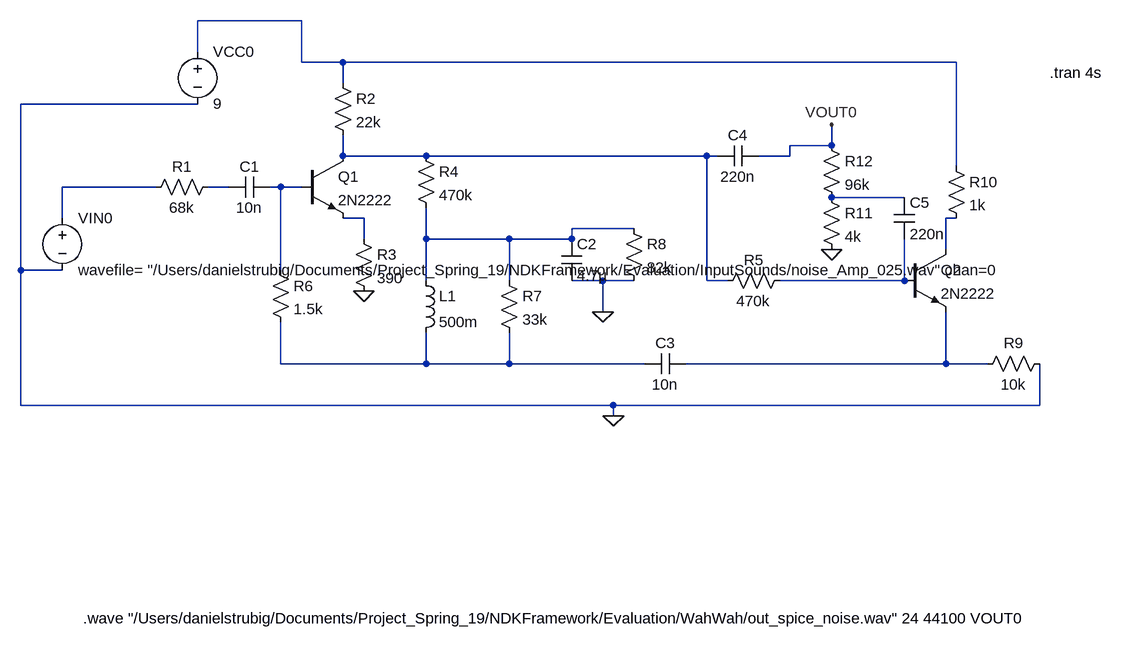
[diagram p0: schematic WahWahPot.asc]
WahWahPot.asc, the LTspice schematic file:
Version 4
SHEET 1 1044 680
WIRE -1232 -816 -1392 -816
WIRE -1392 -768 -1392 -816
WIRE -1232 -752 -1232 -816
WIRE -1168 -752 -1232 -752
WIRE -224 -752 -1168 -752
WIRE -1168 -720 -1168 -752
WIRE -1392 -688 -1664 -688
WIRE -416 -624 -416 -656
WIRE -416 -624 -480 -624
WIRE -1168 -608 -1168 -640
WIRE -1040 -608 -1168 -608
WIRE -608 -608 -1040 -608
WIRE -592 -608 -608 -608
WIRE -480 -608 -480 -624
WIRE -480 -608 -528 -608
WIRE -224 -592 -224 -752
WIRE -1456 -560 -1600 -560
WIRE -1344 -560 -1376 -560
WIRE -1264 -560 -1280 -560
WIRE -1232 -560 -1264 -560
WIRE -304 -544 -416 -544
WIRE -1600 -512 -1600 -560
WIRE -1136 -512 -1168 -512
WIRE -224 -512 -240 -512
WIRE -720 -496 -816 -496
WIRE -1136 -480 -1136 -512
WIRE -1040 -480 -1040 -528
WIRE -912 -480 -1040 -480
WIRE -816 -480 -816 -496
WIRE -816 -480 -912 -480
WIRE -240 -464 -240 -512
WIRE -1664 -432 -1664 -688
WIRE -1600 -432 -1664 -432
WIRE -1264 -432 -1264 -560
WIRE -1040 -416 -1040 -480
WIRE -912 -416 -912 -480
WIRE -768 -416 -816 -416
WIRE -720 -416 -768 -416
WIRE -608 -416 -608 -608
WIRE -576 -416 -608 -416
WIRE -304 -416 -304 -480
WIRE -304 -416 -496 -416
WIRE -768 -368 -768 -416
WIRE -1264 -288 -1264 -352
WIRE -1040 -288 -1040 -336
WIRE -1040 -288 -1264 -288
WIRE -912 -288 -912 -336
WIRE -912 -288 -1040 -288
WIRE -704 -288 -912 -288
WIRE -240 -288 -240 -368
WIRE -240 -288 -640 -288
WIRE -176 -288 -240 -288
WIRE -1664 -224 -1664 -432
WIRE -752 -224 -1664 -224
WIRE -96 -224 -96 -288
WIRE -96 -224 -752 -224
WIRE -752 -208 -752 -224
FLAG -416 -464 0
FLAG -752 -208 0
FLAG -1136 -400 0
FLAG -768 -368 0
FLAG -416 -656 VOUT0
SYMBOL /voltage -1600 -528 R0
SYMATTR InstName VIN0
SYMATTR Value wavefile= "/Users/danielstrubig/Documents/Project_Spring_19/NDKFramework/Evaluation/InputSounds/noise_Amp_025.wav" chan=0
SYMBOL /voltage -1392 -784 R0
SYMATTR InstName VCC0
SYMATTR Value 9
SYMBOL /res -1472 -544 R270
WINDOW 0 32 56 VTop 2
WINDOW 3 0 56 VBottom 2
SYMATTR InstName R1
SYMATTR Value 68k
SYMBOL /res -1184 -736 R0
SYMATTR InstName R2
SYMATTR Value 22k
SYMBOL /res -1152 -496 R0
SYMATTR InstName R3
SYMATTR Value 390
SYMBOL /res -1056 -624 R0
SYMATTR InstName R4
SYMATTR Value 470k
SYMBOL /res -480 -432 R90
WINDOW 0 0 56 VBottom 2
WINDOW 3 32 56 VTop 2
SYMATTR InstName R5
SYMATTR Value 470k
SYMBOL /res -1280 -448 R0
SYMATTR InstName R6
SYMATTR Value 1.5k
SYMBOL /res -928 -432 R0
SYMATTR InstName R7
SYMATTR Value 33k
SYMBOL /res -736 -512 R0
SYMATTR InstName R8
SYMATTR Value 82k
SYMBOL /res -80 -304 R90
WINDOW 0 0 56 VBottom 2
WINDOW 3 32 56 VTop 2
SYMATTR InstName R9
SYMATTR Value 10k
SYMBOL /res -240 -608 R0
SYMATTR InstName R10
SYMATTR Value 1k
SYMBOL /cap -1344 -544 R270
WINDOW 0 32 32 VTop 2
WINDOW 3 0 32 VBottom 2
SYMATTR InstName C1
SYMATTR Value 10n
SYMBOL /cap -832 -480 R0
SYMATTR InstName C2
SYMATTR Value 4.7µ
SYMBOL /cap -704 -272 R270
WINDOW 0 32 32 VTop 2
WINDOW 3 0 32 VBottom 2
SYMATTR InstName C3
SYMATTR Value 10n
SYMBOL /cap -528 -624 R90
WINDOW 0 0 32 VBottom 2
WINDOW 3 32 32 VTop 2
SYMATTR InstName C4
SYMATTR Value 220n
SYMBOL /cap -320 -544 R0
SYMATTR InstName C5
SYMATTR Value 220n
SYMBOL /ind -1056 -432 R0
SYMATTR InstName L1
SYMATTR Value 500m
SYMBOL /npn -1232 -608 R0
SYMATTR InstName Q1
SYMATTR Value 2N2222
SYMBOL /npn -304 -464 R0
SYMATTR InstName Q2
SYMATTR Value 2N2222
SYMBOL /res -432 -560 R0
SYMATTR InstName R11
SYMATTR Value 4k
SYMBOL /res -432 -640 R0
SYMATTR InstName R12
SYMATTR Value 96k
TEXT -80 -736 Left 2 !.tran 4s
TEXT -1568 104 Left 2 !.wave "/Users/danielstrubig/Documents/Project_Spring_19/NDKFramework/Evaluation/WahWah/out_spice_noise.wav" 24 44100 VOUT0

The netlist it stands for:
* WahWahPot.asc
VIN0 N003 0 wavefile= "/Users/danielstrubig/Documents/Project_Spring_19/NDKFramework/Evaluation/InputSounds/noise_Amp_025.wav" chan=0
VCC0 N001 0 9
R1 N003 N004 68k
R2 N001 N002 22k
R3 N007 0 390
R4 N002 N009 470k
R5 N010 N002 470k
R6 N005 N011 1.5k
R7 N009 N011 33k
R8 N009 0 82k
R9 0 N012 10k
R10 N001 N008 1k
C1 N004 N005 10n
C2 N009 0 4.7µ
C3 N011 N012 10n
C4 VOUT0 N002 220n
C5 N006 N010 220n
L1 N009 N011 500m
Q1 N002 N005 N007 0 2N2222
Q2 N008 N010 N012 0 2N2222
R11 N006 0 4k
R12 VOUT0 N006 96k
.model NPN NPN
.model PNP PNP
.lib standard.bjt
.tran 4s
.wave "/Users/danielstrubig/Documents/Project_Spring_19/NDKFramework/Evaluation/WahWah/out_spice_noise.wav" 24 44100 VOUT0
.backanno
.end